# Altium schematic sheet cyc_v_som_A.SchDoc
size A3
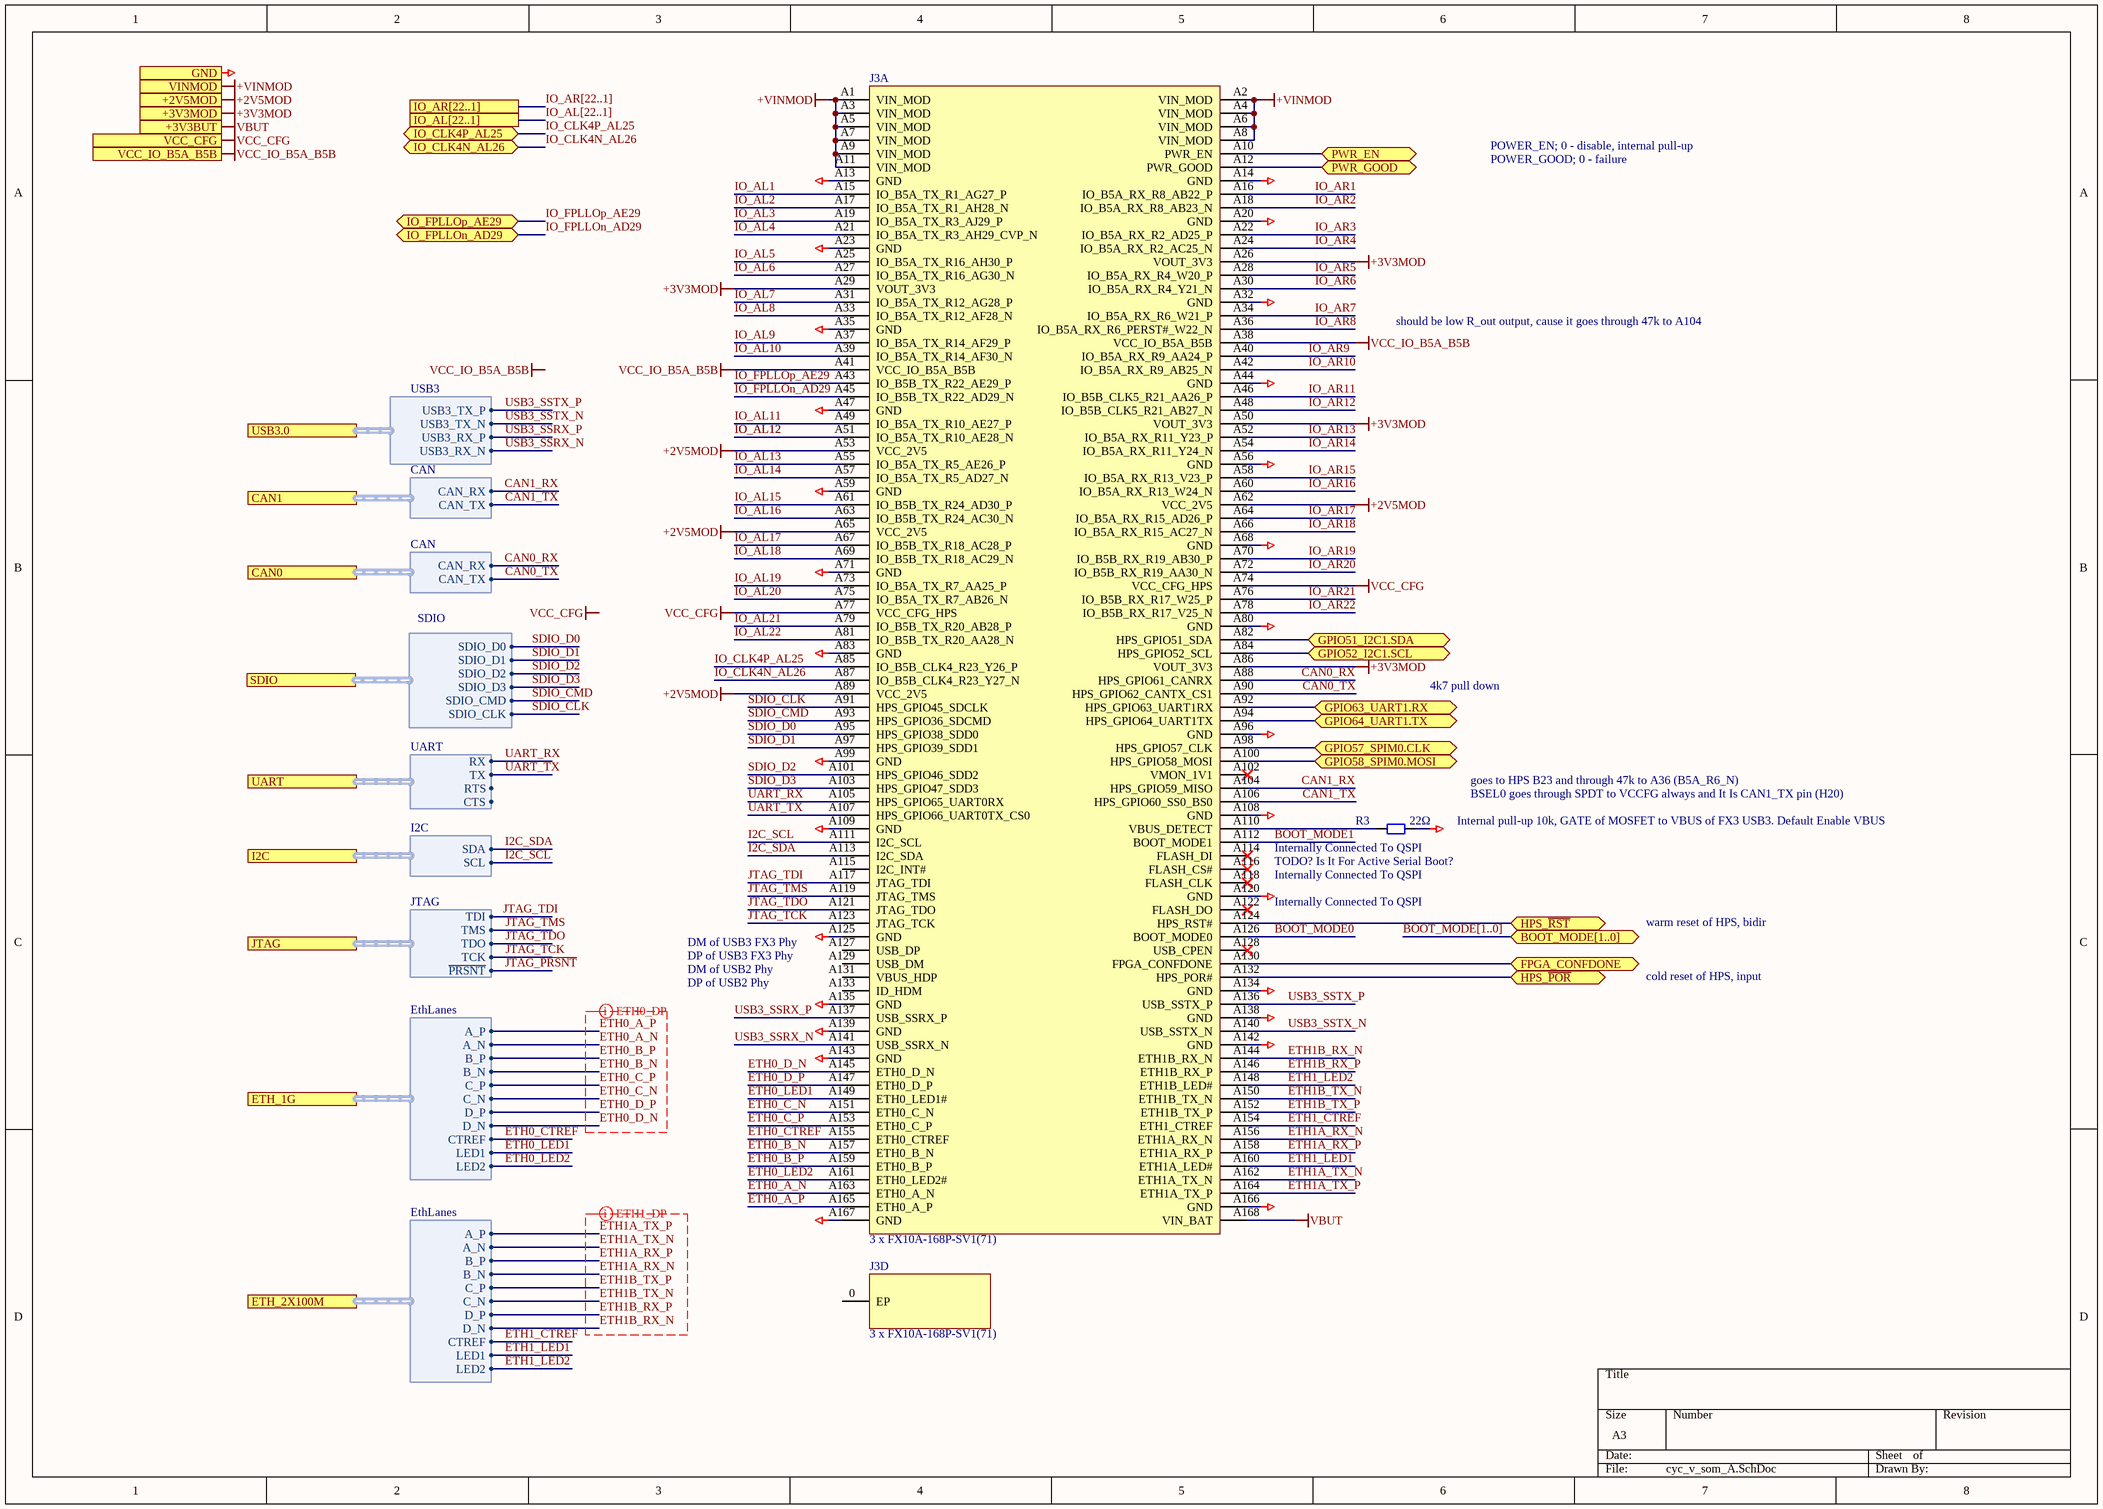
[diagram p0: cyc_v_som_A.SchDoc]

## Parts
J3  3 x FX10A-168P-SV1(71)  [Mercury_SA2p]  (parts A,D of 4)
R3  22Ω  [RESC1608N]

## Ports
+2V5MOD, +3V3BUT, +3V3MOD, BOOT_MODE[1..0] (bidir), CAN0 (harness CAN), CAN1 (harness CAN), ETH_1G (harness EthLanes), ETH_2X100M (harness EthLanes), FPGA_CONFDONE (bidir), GND, GPIO51_I2C1.SDA (bidir), GPIO52_I2C1.SCL (bidir), GPIO57_SPIM0.CLK (bidir), GPIO58_SPIM0.MOSI (bidir), GPIO63_UART1.RX (bidir), GPIO64_UART1.TX (bidir), HPS_~{POR} (bidir), HPS_~{RST} (bidir), I2C (harness I2C), IO_AL[22..1], IO_AR[22..1], IO_CLK4N_AL26 (bidir), IO_CLK4P_AL25 (bidir), IO_FPLLOn_AD29 (bidir), IO_FPLLOp_AE29 (bidir), JTAG (harness JTAG), PWR_EN (bidir), PWR_GOOD (bidir), SDIO (harness SDIO), UART (harness UART), USB3.0 (harness USB3), VCC_CFG, VCC_IO_B5A_B5B, VINMOD

## Harnesses
EthLanes: A_P, A_N, B_P, B_N, C_P, C_N, D_P, D_N, LED1, LED2, CTREF
I2C: SDA, SCL
UART: RX, TX, RTS, CTS
JTAG: TDI, TMS, TDO, TCK, ~{PRSNT}
SDIO: SDIO_D0, SDIO_D1, SDIO_D2, SDIO_D3, SDIO_CMD, SDIO_CLK
CAN: CAN_TX, CAN_RX
USB3: USB3_TX_P, USB3_TX_N, USB3_RX_P, USB3_RX_N

## Nets
+2V5MOD: J3.A53(VCC_2V5) J3.A62(VCC_2V5) J3.A65(VCC_2V5) J3.A89(VCC_2V5) ; port +2V5MOD
+3V3MOD: J3.A26(VOUT_3V3) J3.A29(VOUT_3V3) J3.A50(VOUT_3V3) J3.A86(VOUT_3V3) ; port +3V3MOD
+VINMOD: J3.A1(VIN_MOD) J3.A2(VIN_MOD) J3.A3(VIN_MOD) J3.A4(VIN_MOD) J3.A5(VIN_MOD) J3.A6(VIN_MOD) J3.A7(VIN_MOD) J3.A8(VIN_MOD) J3.A9(VIN_MOD) J3.A11(VIN_MOD) ; port VINMOD
GND: J3.A13(GND) J3.A14(GND) J3.A20(GND) J3.A23(GND) J3.A32(GND) J3.A35(GND) J3.A44(GND) J3.A47(GND) J3.A56(GND) J3.A59(GND) J3.A68(GND) J3.A71(GND) J3.A80(GND) J3.A83(GND) J3.A96(GND) J3.A99(GND) J3.A108(GND) J3.A109(GND) J3.A120(GND) J3.A125(GND) J3.A134(GND) J3.A135(GND) J3.A138(GND) J3.A139(GND) J3.A142(GND) J3.A143(GND) J3.A166(GND) J3.A167(GND) R3.2 ; port GND
VBUT: J3.A168(VIN_BAT) ; port +3V3BUT
VCC_CFG: J3.A74(VCC_CFG_HPS) J3.A77(VCC_CFG_HPS) ; port VCC_CFG
VCC_IO_B5A_B5B: J3.A38(VCC_IO_B5A_B5B) J3.A41(VCC_IO_B5A_B5B) ; port VCC_IO_B5A_B5B
BOOT_MODE0: J3.A126(BOOT_MODE0)
BOOT_MODE1: J3.A112(BOOT_MODE1)
CAN0_RX: J3.A88(HPS_GPIO61_CANRX) ; port CAN0.CAN_RX
CAN0_TX: J3.A90(HPS_GPIO62_CANTX_CS1) ; port CAN0.CAN_TX
CAN1_RX: J3.A104(HPS_GPIO59_MISO) ; port CAN1.CAN_RX
CAN1_TX: J3.A106(HPS_GPIO60_SS0_BS0) ; port CAN1.CAN_TX
ETH0_A_N: J3.A163(ETH0_A_N) ; port ETH_1G.A_N
ETH0_A_P: J3.A165(ETH0_A_P) ; port ETH_1G.A_P
ETH0_B_N: J3.A157(ETH0_B_N) ; port ETH_1G.B_N
ETH0_B_P: J3.A159(ETH0_B_P) ; port ETH_1G.B_P
ETH0_C_N: J3.A151(ETH0_C_N) ; port ETH_1G.C_N
ETH0_C_P: J3.A153(ETH0_C_P) ; port ETH_1G.C_P
ETH0_CTREF: J3.A155(ETH0_CTREF) ; port ETH_1G.CTREF
ETH0_D_N: J3.A145(ETH0_D_N) ; port ETH_1G.D_N
ETH0_D_P: J3.A147(ETH0_D_P) ; port ETH_1G.D_P
ETH0_LED1: J3.A149(ETH0_LED1#) ; port ETH_1G.LED1
ETH0_LED2: J3.A161(ETH0_LED2#) ; port ETH_1G.LED2
ETH1_CTREF: J3.A154(ETH1_CTREF) ; port ETH_2X100M.CTREF
ETH1_LED1: J3.A160(ETH1A_LED#) ; port ETH_2X100M.LED1
ETH1_LED2: J3.A148(ETH1B_LED#) ; port ETH_2X100M.LED2
ETH1A_RX_N: J3.A156(ETH1A_RX_N) ; port ETH_2X100M.B_N
ETH1A_RX_P: J3.A158(ETH1A_RX_P) ; port ETH_2X100M.B_P
ETH1A_TX_N: J3.A162(ETH1A_TX_N) ; port ETH_2X100M.A_N
ETH1A_TX_P: J3.A164(ETH1A_TX_P) ; port ETH_2X100M.A_P
ETH1B_RX_N: J3.A144(ETH1B_RX_N) ; port ETH_2X100M.D_N
ETH1B_RX_P: J3.A146(ETH1B_RX_P) ; port ETH_2X100M.D_P
ETH1B_TX_N: J3.A150(ETH1B_TX_N) ; port ETH_2X100M.C_N
ETH1B_TX_P: J3.A152(ETH1B_TX_P) ; port ETH_2X100M.C_P
FPGA_CONFDONE: J3.A130(FPGA_CONFDONE) ; port FPGA_CONFDONE
GPIO51_I2C1.SDA: J3.A82(HPS_GPIO51_SDA) ; port GPIO51_I2C1.SDA
GPIO52_I2C1.SCL: J3.A84(HPS_GPIO52_SCL) ; port GPIO52_I2C1.SCL
GPIO57_SPIM0.CLK: J3.A98(HPS_GPIO57_CLK) ; port GPIO57_SPIM0.CLK
GPIO58_SPIM0.MOSI: J3.A100(HPS_GPIO58_MOSI) ; port GPIO58_SPIM0.MOSI
GPIO63_UART1.RX: J3.A92(HPS_GPIO63_UART1RX) ; port GPIO63_UART1.RX
GPIO64_UART1.TX: J3.A94(HPS_GPIO64_UART1TX) ; port GPIO64_UART1.TX
HPS_~{POR}: J3.A132(HPS_POR#) ; port HPS_~{POR}
HPS_~{RST}: J3.A124(HPS_RST#) ; port HPS_~{RST}
I2C_SCL: J3.A111(I2C_SCL) ; port I2C.SCL
I2C_SDA: J3.A113(I2C_SDA) ; port I2C.SDA
IO_AL1: J3.A15(IO_B5A_TX_R1_AG27_P)
IO_AL2: J3.A17(IO_B5A_TX_R1_AH28_N)
IO_AL3: J3.A19(IO_B5A_TX_R3_AJ29_P)
IO_AL4: J3.A21(IO_B5A_TX_R3_AH29_CVP_N)
IO_AL5: J3.A25(IO_B5A_TX_R16_AH30_P)
IO_AL6: J3.A27(IO_B5A_TX_R16_AG30_N)
IO_AL7: J3.A31(IO_B5A_TX_R12_AG28_P)
IO_AL8: J3.A33(IO_B5A_TX_R12_AF28_N)
IO_AL9: J3.A37(IO_B5A_TX_R14_AF29_P)
IO_AL10: J3.A39(IO_B5A_TX_R14_AF30_N)
IO_AL11: J3.A49(IO_B5A_TX_R10_AE27_P)
IO_AL12: J3.A51(IO_B5A_TX_R10_AE28_N)
IO_AL13: J3.A55(IO_B5A_TX_R5_AE26_P)
IO_AL14: J3.A57(IO_B5A_TX_R5_AD27_N)
IO_AL15: J3.A61(IO_B5B_TX_R24_AD30_P)
IO_AL16: J3.A63(IO_B5B_TX_R24_AC30_N)
IO_AL17: J3.A67(IO_B5B_TX_R18_AC28_P)
IO_AL18: J3.A69(IO_B5B_TX_R18_AC29_N)
IO_AL19: J3.A73(IO_B5A_TX_R7_AA25_P)
IO_AL20: J3.A75(IO_B5A_TX_R7_AB26_N)
IO_AL21: J3.A79(IO_B5B_TX_R20_AB28_P)
IO_AL22: J3.A81(IO_B5B_TX_R20_AA28_N)
IO_AR1: J3.A16(IO_B5A_RX_R8_AB22_P)
IO_AR2: J3.A18(IO_B5A_RX_R8_AB23_N)
IO_AR3: J3.A22(IO_B5A_RX_R2_AD25_P)
IO_AR4: J3.A24(IO_B5A_RX_R2_AC25_N)
IO_AR5: J3.A28(IO_B5A_RX_R4_W20_P)
IO_AR6: J3.A30(IO_B5A_RX_R4_Y21_N)
IO_AR7: J3.A34(IO_B5A_RX_R6_W21_P)
IO_AR8: J3.A36(IO_B5A_RX_R6_PERST#_W22_N)
IO_AR9: J3.A40(IO_B5A_RX_R9_AA24_P)
IO_AR10: J3.A42(IO_B5A_RX_R9_AB25_N)
IO_AR11: J3.A46(IO_B5B_CLK5_R21_AA26_P)
IO_AR12: J3.A48(IO_B5B_CLK5_R21_AB27_N)
IO_AR13: J3.A52(IO_B5A_RX_R11_Y23_P)
IO_AR14: J3.A54(IO_B5A_RX_R11_Y24_N)
IO_AR15: J3.A58(IO_B5A_RX_R13_V23_P)
IO_AR16: J3.A60(IO_B5A_RX_R13_W24_N)
IO_AR17: J3.A64(IO_B5A_RX_R15_AD26_P)
IO_AR18: J3.A66(IO_B5A_RX_R15_AC27_N)
IO_AR19: J3.A70(IO_B5B_RX_R19_AB30_P)
IO_AR20: J3.A72(IO_B5B_RX_R19_AA30_N)
IO_AR21: J3.A76(IO_B5B_RX_R17_W25_P)
IO_AR22: J3.A78(IO_B5B_RX_R17_V25_N)
IO_CLK4N_AL26: J3.A87(IO_B5B_CLK4_R23_Y27_N) ; port IO_CLK4N_AL26
IO_CLK4P_AL25: J3.A85(IO_B5B_CLK4_R23_Y26_P) ; port IO_CLK4P_AL25
IO_FPLLOn_AD29: J3.A45(IO_B5B_TX_R22_AD29_N) ; port IO_FPLLOn_AD29
IO_FPLLOp_AE29: J3.A43(IO_B5B_TX_R22_AE29_P) ; port IO_FPLLOp_AE29
JTAG_~{PRSNT}: port JTAG.~{PRSNT}
JTAG_TCK: J3.A123(JTAG_TCK) ; port JTAG.TCK
JTAG_TDI: J3.A117(JTAG_TDI) ; port JTAG.TDI
JTAG_TDO: J3.A121(JTAG_TDO) ; port JTAG.TDO
JTAG_TMS: J3.A119(JTAG_TMS) ; port JTAG.TMS
PWR_EN: J3.A10(PWR_EN) ; port PWR_EN
PWR_GOOD: J3.A12(PWR_GOOD) ; port PWR_GOOD
SDIO_CLK: J3.A91(HPS_GPIO45_SDCLK) ; port SDIO.SDIO_CLK
SDIO_CMD: J3.A93(HPS_GPIO36_SDCMD) ; port SDIO.SDIO_CMD
SDIO_D0: J3.A95(HPS_GPIO38_SDD0) ; port SDIO.SDIO_D0
SDIO_D1: J3.A97(HPS_GPIO39_SDD1) ; port SDIO.SDIO_D1
SDIO_D2: J3.A101(HPS_GPIO46_SDD2) ; port SDIO.SDIO_D2
SDIO_D3: J3.A103(HPS_GPIO47_SDD3) ; port SDIO.SDIO_D3
UART_RX: J3.A105(HPS_GPIO65_UART0RX) ; port UART.RX
UART_TX: J3.A107(HPS_GPIO66_UART0TX_CS0) ; port UART.TX
USB3_SSRX_N: J3.A141(USB_SSRX_N) ; port USB3.0.USB3_RX_N
USB3_SSRX_P: J3.A137(USB_SSRX_P) ; port USB3.0.USB3_RX_P
USB3_SSTX_N: J3.A140(USB_SSTX_N) ; port USB3.0.USB3_TX_N
USB3_SSTX_P: J3.A136(USB_SSTX_P) ; port USB3.0.USB3_TX_P
NetJ3_A110: J3.A110(VBUS_DETECT) R3.1

Not connected (* = marked no-connect by the designer): J3 0(EP) A102(VMON_1V1)* A114(FLASH_DI)* A115(I2C_INT#) A116(FLASH_CS#)* A118(FLASH_CLK)* A122(FLASH_DO)* A127(USB_DP) A128(USB_CPEN)* A129(USB_DM) A131(VBUS_HDP) A133(ID_HDM)

## Buses and harness runs
bus BOOT_MODE[1..0] = port BOOT_MODE[1..0]
bus IO_AL[22..1] = port IO_AL[22..1]
bus IO_AR[22..1] = port IO_AR[22..1]

## Layout directives
differential pair; rule Differential Pairs Routing [Pref Gap = 0.175mm    Min Gap  = 0.075mm    Max Gap  = 0.5mmPref Width = 0.25mm    Min Width  = 0.075mm    Max Width  = 0.5mm]: ETH0_A_N, ETH0_A_P, ETH0_B_N, ETH0_B_P, ETH0_C_N, ETH0_C_P, ETH0_D_N, ETH0_D_P, ETH1A_RX_N, ETH1A_RX_P, ETH1A_TX_N, ETH1A_TX_P, ETH1B_RX_N, ETH1B_RX_P, ETH1B_TX_N, ETH1B_TX_P

## Notes on the sheet
- POWER_GOOD; 0 - failure
- POWER_EN; 0 - disable, internal pull-up
- should be low R_out output, cause it goes through 47k to A104
- 4k7 pull down
- goes to HPS B23 and through 47k to A36 (B5A_R6_N)
- (near R3) Internally Connected To QSPI
- (near R3) Internal pull-up 10k, GATE of MOSFET to VBUS of FX3 USB3. Default Enable VBUS
- BSEL0 goes through SPDT to VCCFG always and It Is CAN1_TX pin (H20)
- (near R3) TODO? Is It For Active Serial Boot?
- Internally Connected To QSPI
- DP of USB2 Phy
- DM of USB2 Phy
- DP of USB3 FX3 Phy
- DM of USB3 FX3 Phy
- warm reset of HPS, bidir
- cold reset of HPS, input
- Labels drawn without touching a wire or pin: VCC_CFG, VCC_IO_B5A_B5B

## Library data of the parts
J3 = FX10A-168P-SV_ME-SA2+: Pin_Count: 168; SolderOption: 0; Pkg: SMD 170pin; SMD Solders: 170; HelpURL: https://www.hirose.com/product/document?clcode=CL0570-0044-8-71&productname=FX10A-168P-SV(71)&series=FX10&documenttype=Catalog&lang=ru&documentid=D31650_en; PartField: FX10A-168P-SV1(71); Value: 3 x FX10A-168P-SV1(71); THD Solders: 0
R3 = RESC: Resistor, Generic, SMD; Pkg: 0603; Maintainer: Evgeniy Kotov; SMD Solders: 2; THD Solders: 0; PartField: 22Ω; Release Date: 06.03.2017; Last Change Data: 09.03.2017; Value: 22Ω